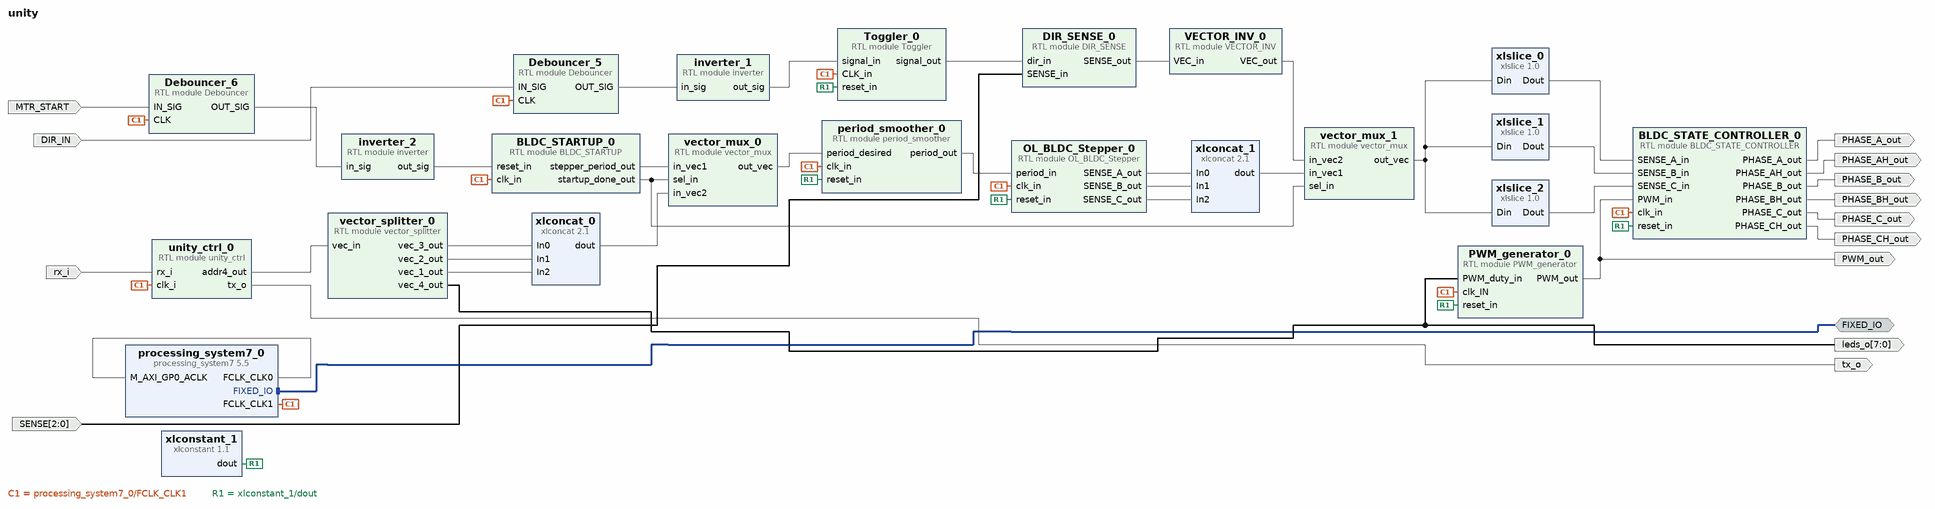
[diagram p0: block diagram of the top level]
# Vivado block design unity, xc7z010clg225-1, Vivado 2016.3
create_bd_design unity

create_bd_intf_port -mode Master -vlnv xilinx.com:display_processing_system7:fixedio_rtl:1.0 FIXED_IO
create_bd_port -dir I rx_i
create_bd_port -dir O tx_o
create_bd_port -dir O PWM_out
create_bd_port -dir O -from 7 -to 0 leds_o
create_bd_port -dir I DIR_IN
create_bd_port -dir I MTR_START
create_bd_port -dir O PHASE_A_out
create_bd_port -dir O PHASE_AH_out
create_bd_port -dir O PHASE_B_out
create_bd_port -dir O PHASE_BH_out
create_bd_port -dir I -from 2 -to 0 SENSE
create_bd_port -dir O PHASE_C_out
create_bd_port -dir O PHASE_CH_out

create_bd_cell -type ip -vlnv xilinx.com:ip:processing_system7:5.5 processing_system7_0
set_property -dict [list \
  CONFIG.PCW_FCLK_CLK1_BUF TRUE \
  CONFIG.PCW_FCLK_CLK2_BUF TRUE \
  CONFIG.PCW_APU_PERIPHERAL_FREQMHZ 666.666666 \
  CONFIG.PCW_FPGA0_PERIPHERAL_FREQMHZ 50 \
  CONFIG.PCW_FPGA1_PERIPHERAL_FREQMHZ 200 \
  CONFIG.PCW_FPGA2_PERIPHERAL_FREQMHZ 100 \
  CONFIG.PCW_M_AXI_GP0_FREQMHZ 50 \
  CONFIG.PCW_NUM_F2P_INTR_INPUTS 1 \
  CONFIG.PCW_DQ_WIDTH 16 \
  CONFIG.PCW_DQS_WIDTH 2 \
  CONFIG.PCW_DM_WIDTH 2 \
  CONFIG.PCW_MIO_PRIMITIVE 32 \
  CONFIG.PCW_EN_CLK1_PORT 1 \
  CONFIG.PCW_EN_CLK2_PORT 1 \
  CONFIG.PCW_PERIPHERAL_BOARD_PRESET part0 \
  CONFIG.PCW_PRESET_BANK1_VOLTAGE {LVCMOS 3.3V} \
  CONFIG.PCW_UIPARAM_DDR_ENABLE 0 \
  CONFIG.PCW_QSPI_PERIPHERAL_ENABLE 1 \
  CONFIG.PCW_QSPI_QSPI_IO {MIO 1 .. 6} \
  CONFIG.PCW_QSPI_GRP_SINGLE_SS_ENABLE 1 \
  CONFIG.PCW_QSPI_GRP_SINGLE_SS_IO {MIO 1 .. 6} \
  CONFIG.PCW_ENET0_PERIPHERAL_ENABLE 0 \
  CONFIG.PCW_SD0_PERIPHERAL_ENABLE 0 \
  CONFIG.PCW_UART1_PERIPHERAL_ENABLE 0 \
  CONFIG.PCW_USB0_PERIPHERAL_ENABLE 0 \
  CONFIG.PCW_USB_RESET_ENABLE 1 \
  CONFIG.PCW_I2C_RESET_ENABLE 1 \
  CONFIG.PCW_GPIO_MIO_GPIO_ENABLE 1 \
  CONFIG.PCW_GPIO_MIO_GPIO_IO MIO \
  CONFIG.PCW_APU_CLK_RATIO_ENABLE 0.251400462962963 \
  CONFIG.PCW_ENET0_PERIPHERAL_CLKSRC External \
  CONFIG.PCW_UIPARAM_GENERATE_SUMMARY NONE \
  CONFIG.PCW_FPGA_FCLK1_ENABLE 1 \
  CONFIG.PCW_FPGA_FCLK2_ENABLE 1 \
] [get_bd_cells processing_system7_0]
# 388 more settings of processing_system7_0 are not shown: defaults, MIO pin electricals, DDR timing, and values the tool derives
create_bd_cell -type ip -vlnv xilinx.com:ip:xlconstant:1.1 xlconstant_1
set_property -dict {CONFIG.CONST_VAL 0} [get_bd_cells xlconstant_1]
create_bd_cell -type module -reference vector_splitter vector_splitter_0
create_bd_cell -type ip -vlnv xilinx.com:ip:xlconcat:2.1 xlconcat_0
set_property -dict {CONFIG.NUM_PORTS 3 CONFIG.IN0_WIDTH 8 CONFIG.IN1_WIDTH 8 CONFIG.IN2_WIDTH 8} [get_bd_cells xlconcat_0]
create_bd_cell -type module -reference unity_ctrl unity_ctrl_0
create_bd_cell -type module -reference PWM_generator PWM_generator_0
create_bd_cell -type module -reference Toggler Toggler_0
create_bd_cell -type module -reference Debouncer Debouncer_5
set_property -dict {CONFIG.THRESHOLD 100000} [get_bd_cells Debouncer_5]
create_bd_cell -type module -reference inverter inverter_1
create_bd_cell -type module -reference BLDC_STARTUP BLDC_STARTUP_0
set_property -dict [list \
  CONFIG.START_PERIOD 2000000 \
  CONFIG.END_PERIOD 100000 \
  CONFIG.SPEEDUP_INTERVAL 100 \
] [get_bd_cells BLDC_STARTUP_0]
create_bd_cell -type module -reference inverter inverter_2
create_bd_cell -type module -reference OL_BLDC_Stepper OL_BLDC_Stepper_0
create_bd_cell -type module -reference period_smoother period_smoother_0
set_property -dict {CONFIG.SMOOTHING 40} [get_bd_cells period_smoother_0]
create_bd_cell -type ip -vlnv xilinx.com:ip:xlconcat:2.1 xlconcat_1
set_property -dict {CONFIG.NUM_PORTS 3 CONFIG.IN0_WIDTH 1 CONFIG.IN1_WIDTH 1 CONFIG.IN2_WIDTH 1} [get_bd_cells xlconcat_1]
create_bd_cell -type ip -vlnv xilinx.com:ip:xlslice:1.0 xlslice_0
set_property -dict {CONFIG.DOUT_WIDTH 1 CONFIG.DIN_TO 0 CONFIG.DIN_FROM 0 CONFIG.DIN_WIDTH 3} [get_bd_cells xlslice_0]
create_bd_cell -type ip -vlnv xilinx.com:ip:xlslice:1.0 xlslice_1
set_property -dict {CONFIG.DOUT_WIDTH 1 CONFIG.DIN_TO 1 CONFIG.DIN_FROM 1 CONFIG.DIN_WIDTH 3} [get_bd_cells xlslice_1]
create_bd_cell -type ip -vlnv xilinx.com:ip:xlslice:1.0 xlslice_2
set_property -dict {CONFIG.DOUT_WIDTH 1 CONFIG.DIN_TO 2 CONFIG.DIN_FROM 2 CONFIG.DIN_WIDTH 3} [get_bd_cells xlslice_2]
create_bd_cell -type module -reference VECTOR_INV VECTOR_INV_0
set_property -dict {CONFIG.SIZE 3} [get_bd_cells VECTOR_INV_0]
create_bd_cell -type module -reference vector_mux vector_mux_0
set_property -dict {CONFIG.SIZE 24} [get_bd_cells vector_mux_0]
create_bd_cell -type module -reference DIR_SENSE DIR_SENSE_0
create_bd_cell -type module -reference BLDC_STATE_CONTROLLER BLDC_STATE_CONTROLLER_0
create_bd_cell -type module -reference Debouncer Debouncer_6
set_property -dict {CONFIG.THRESHOLD 100000} [get_bd_cells Debouncer_6]
create_bd_cell -type module -reference vector_mux vector_mux_1
set_property -dict {CONFIG.SIZE 3} [get_bd_cells vector_mux_1]

# ---- connections ----

connect_bd_intf_net [get_bd_intf_ports FIXED_IO] [get_bd_intf_pins processing_system7_0/FIXED_IO]
connect_bd_net [get_bd_pins processing_system7_0/FCLK_CLK0] [get_bd_pins processing_system7_0/M_AXI_GP0_ACLK]
connect_bd_net [get_bd_pins processing_system7_0/FCLK_CLK1] \
  [get_bd_pins unity_ctrl_0/clk_i] [get_bd_pins PWM_generator_0/clk_IN] [get_bd_pins Toggler_0/CLK_in] \
  [get_bd_pins Debouncer_5/CLK] [get_bd_pins BLDC_STARTUP_0/clk_in] [get_bd_pins OL_BLDC_Stepper_0/clk_in] \
  [get_bd_pins period_smoother_0/clk_in] [get_bd_pins BLDC_STATE_CONTROLLER_0/clk_in] [get_bd_pins Debouncer_6/CLK]
connect_bd_net [get_bd_ports rx_i] [get_bd_pins unity_ctrl_0/rx_i]
connect_bd_net [get_bd_pins unity_ctrl_0/tx_o] [get_bd_ports tx_o]
connect_bd_net [get_bd_pins PWM_generator_0/PWM_out] [get_bd_ports PWM_out] [get_bd_pins BLDC_STATE_CONTROLLER_0/PWM_in]
connect_bd_net [get_bd_pins xlconstant_1/dout] \
  [get_bd_pins PWM_generator_0/reset_in] [get_bd_pins Toggler_0/reset_in] [get_bd_pins OL_BLDC_Stepper_0/reset_in] \
  [get_bd_pins period_smoother_0/reset_in] [get_bd_pins BLDC_STATE_CONTROLLER_0/reset_in]
connect_bd_net -net unity_ctrl_0_leds_o [get_bd_pins vector_splitter_0/vec_4_out] [get_bd_ports leds_o] [get_bd_pins PWM_generator_0/PWM_duty_in]
connect_bd_net -net unity_ctrl_0_out_addr4 [get_bd_pins unity_ctrl_0/addr4_out] [get_bd_pins vector_splitter_0/vec_in]
connect_bd_net [get_bd_pins vector_splitter_0/vec_3_out] [get_bd_pins xlconcat_0/In0]
connect_bd_net [get_bd_pins vector_splitter_0/vec_2_out] [get_bd_pins xlconcat_0/In1]
connect_bd_net [get_bd_pins vector_splitter_0/vec_1_out] [get_bd_pins xlconcat_0/In2]
connect_bd_net [get_bd_pins Debouncer_5/OUT_SIG] [get_bd_pins inverter_1/in_sig]
connect_bd_net [get_bd_pins inverter_1/out_sig] [get_bd_pins Toggler_0/signal_in]
connect_bd_net -net MOTOR_BTN_IN_1 [get_bd_ports DIR_IN] [get_bd_pins Debouncer_5/IN_SIG]
connect_bd_net [get_bd_pins BLDC_STARTUP_0/startup_done_out] [get_bd_pins vector_mux_0/sel_in] [get_bd_pins vector_mux_1/sel_in]
connect_bd_net [get_bd_pins BLDC_STARTUP_0/stepper_period_out] [get_bd_pins vector_mux_0/in_vec1]
connect_bd_net -net DIR_IN1_1 [get_bd_ports MTR_START] [get_bd_pins Debouncer_6/IN_SIG]
connect_bd_net [get_bd_pins Debouncer_6/OUT_SIG] [get_bd_pins inverter_2/in_sig]
connect_bd_net [get_bd_pins inverter_2/out_sig] [get_bd_pins BLDC_STARTUP_0/reset_in]
connect_bd_net [get_bd_pins Toggler_0/signal_out] [get_bd_pins DIR_SENSE_0/dir_in]
connect_bd_net [get_bd_pins xlconcat_0/dout] [get_bd_pins vector_mux_0/in_vec2]
connect_bd_net [get_bd_pins vector_mux_0/out_vec] [get_bd_pins period_smoother_0/period_desired]
connect_bd_net [get_bd_pins period_smoother_0/period_out] [get_bd_pins OL_BLDC_Stepper_0/period_in]
connect_bd_net [get_bd_pins OL_BLDC_Stepper_0/SENSE_A_out] [get_bd_pins xlconcat_1/In0]
connect_bd_net [get_bd_pins OL_BLDC_Stepper_0/SENSE_B_out] [get_bd_pins xlconcat_1/In1]
connect_bd_net [get_bd_pins OL_BLDC_Stepper_0/SENSE_C_out] [get_bd_pins xlconcat_1/In2]
connect_bd_net [get_bd_pins xlconcat_1/dout] [get_bd_pins vector_mux_1/in_vec1]
connect_bd_net [get_bd_pins vector_mux_1/out_vec] [get_bd_pins xlslice_0/Din] [get_bd_pins xlslice_1/Din] [get_bd_pins xlslice_2/Din]
connect_bd_net [get_bd_pins VECTOR_INV_0/VEC_out] [get_bd_pins vector_mux_1/in_vec2]
connect_bd_net [get_bd_ports SENSE] [get_bd_pins DIR_SENSE_0/SENSE_in]
connect_bd_net [get_bd_pins DIR_SENSE_0/SENSE_out] [get_bd_pins VECTOR_INV_0/VEC_in]
connect_bd_net [get_bd_pins xlslice_0/Dout] [get_bd_pins BLDC_STATE_CONTROLLER_0/SENSE_A_in]
connect_bd_net [get_bd_pins xlslice_1/Dout] [get_bd_pins BLDC_STATE_CONTROLLER_0/SENSE_B_in]
connect_bd_net [get_bd_pins xlslice_2/Dout] [get_bd_pins BLDC_STATE_CONTROLLER_0/SENSE_C_in]
connect_bd_net [get_bd_pins BLDC_STATE_CONTROLLER_0/PHASE_C_out] [get_bd_ports PHASE_C_out]
connect_bd_net [get_bd_pins BLDC_STATE_CONTROLLER_0/PHASE_CH_out] [get_bd_ports PHASE_CH_out]
connect_bd_net [get_bd_pins BLDC_STATE_CONTROLLER_0/PHASE_A_out] [get_bd_ports PHASE_A_out]
connect_bd_net [get_bd_pins BLDC_STATE_CONTROLLER_0/PHASE_B_out] [get_bd_ports PHASE_B_out]
connect_bd_net [get_bd_pins BLDC_STATE_CONTROLLER_0/PHASE_AH_out] [get_bd_ports PHASE_AH_out]
connect_bd_net [get_bd_pins BLDC_STATE_CONTROLLER_0/PHASE_BH_out] [get_bd_ports PHASE_BH_out]

validate_bd_design
save_bd_design
